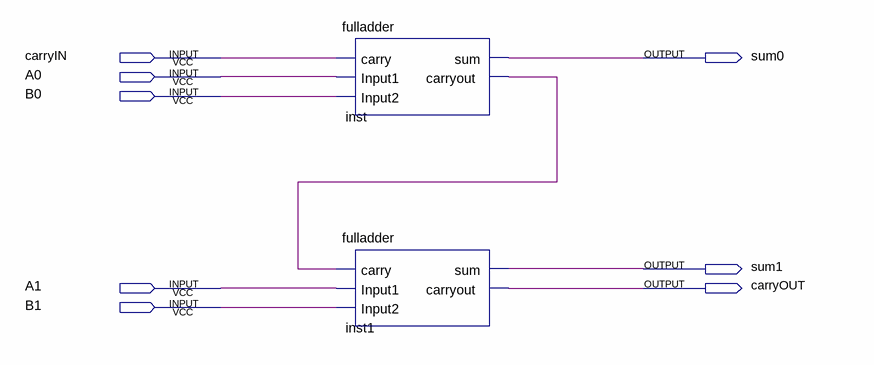
[diagram p0: schematic sheet]
// Quartus schematic fulladder2bit.bdf as structural Verilog: 2 symbols, 8 pins
module fulladder2bit (
  input  carryIN,
  input  A0,
  input  B0,
  input  A1,
  input  B1,
  output sum0,
  output sum1,
  output carryOUT
);

  wire inst_carryout;

  fulladder inst (.carry(carryIN), .Input1(A0), .Input2(B0), .sum(sum0), .carryout(inst_carryout));
  fulladder inst1 (.carry(inst_carryout), .Input1(A1), .Input2(B1), .sum(sum1), .carryout(carryOUT));
endmodule
